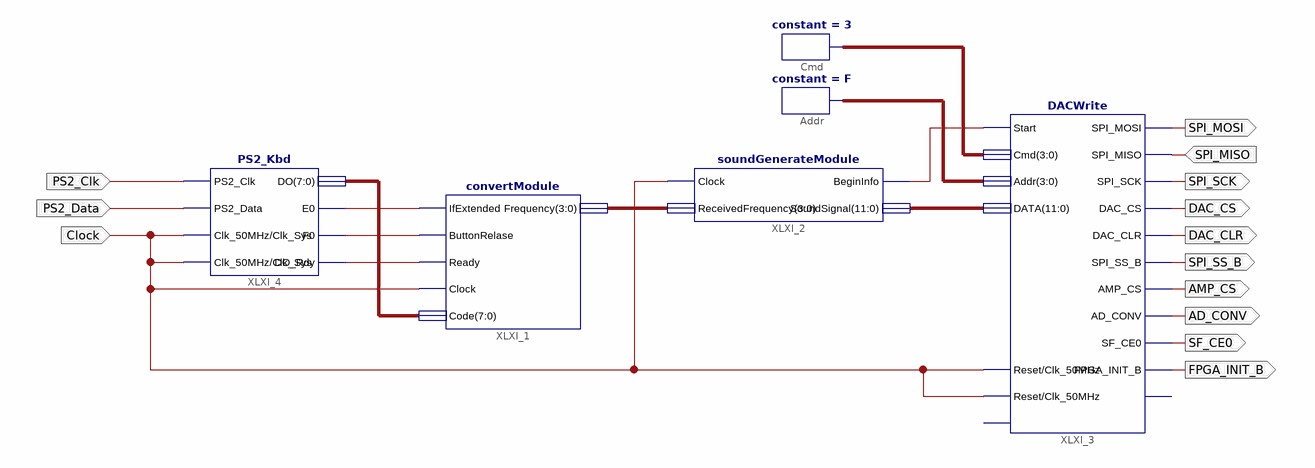
[diagram p0: schematic sheet 1]
// Xilinx ISE schematic schematic.sch (xc9500xl) as structural Verilog: 6 symbols, 13 ports
module schematic (
  input  PS2_Clk,
  input  PS2_Data,
  input  Clock,
  input  SPI_MISO,
  output SPI_MOSI,
  output SPI_SCK,
  output DAC_CS,
  output DAC_CLR,
  output SPI_SS_B,
  output AMP_CS,
  output AD_CONV,
  output SF_CE0,
  output FPGA_INIT_B
);

  wire XLXN_1, XLXN_2, XLXN_3, XLXN_6;
  wire [3:0] XLXN_4, XLXN_9, XLXN_10;
  wire [7:0] XLXN_19;
  wire [11:0] XLXN_5;

  convertModule XLXI_1 (
    .IfExtended(XLXN_1), .ButtonRelase(XLXN_2), .Ready(XLXN_3), .Clock(Clock), .Code(XLXN_19),
    .Frequency(XLXN_4));
  soundGenerateModule XLXI_2 (.Clock(Clock), .ReceivedFrequency(XLXN_4), .BeginInfo(XLXN_6), .SoundSignal(XLXN_5));
  DACWrite XLXI_3 (
    .Reset(Clock), .Start(XLXN_6), .SPI_MISO(SPI_MISO), .Cmd(XLXN_9), .Addr(XLXN_10), .DATA(XLXN_5),
    .DAC_CLR(DAC_CLR), .DAC_CS(DAC_CS), .SPI_MOSI(SPI_MOSI), .SPI_SCK(SPI_SCK), .SPI_SS_B(SPI_SS_B),
    .AMP_CS(AMP_CS), .AD_CONV(AD_CONV), .SF_CE0(SF_CE0), .FPGA_INIT_B(FPGA_INIT_B), .Clk_50MHz(Clock));  // open: Busy, Clk_Sys
  PS2_Kbd XLXI_4 (
    .PS2_Clk(PS2_Clk), .PS2_Data(PS2_Data), .Clk_50MHz(Clock), .E0(XLXN_1), .F0(XLXN_2), .DO_Rdy(XLXN_3),
    .DO(XLXN_19), .Clk_Sys(Clock));
  constant #(.CValue("F")) Addr (.O(XLXN_10));
  constant #(.CValue("3")) Cmd (.O(XLXN_9));
endmodule
